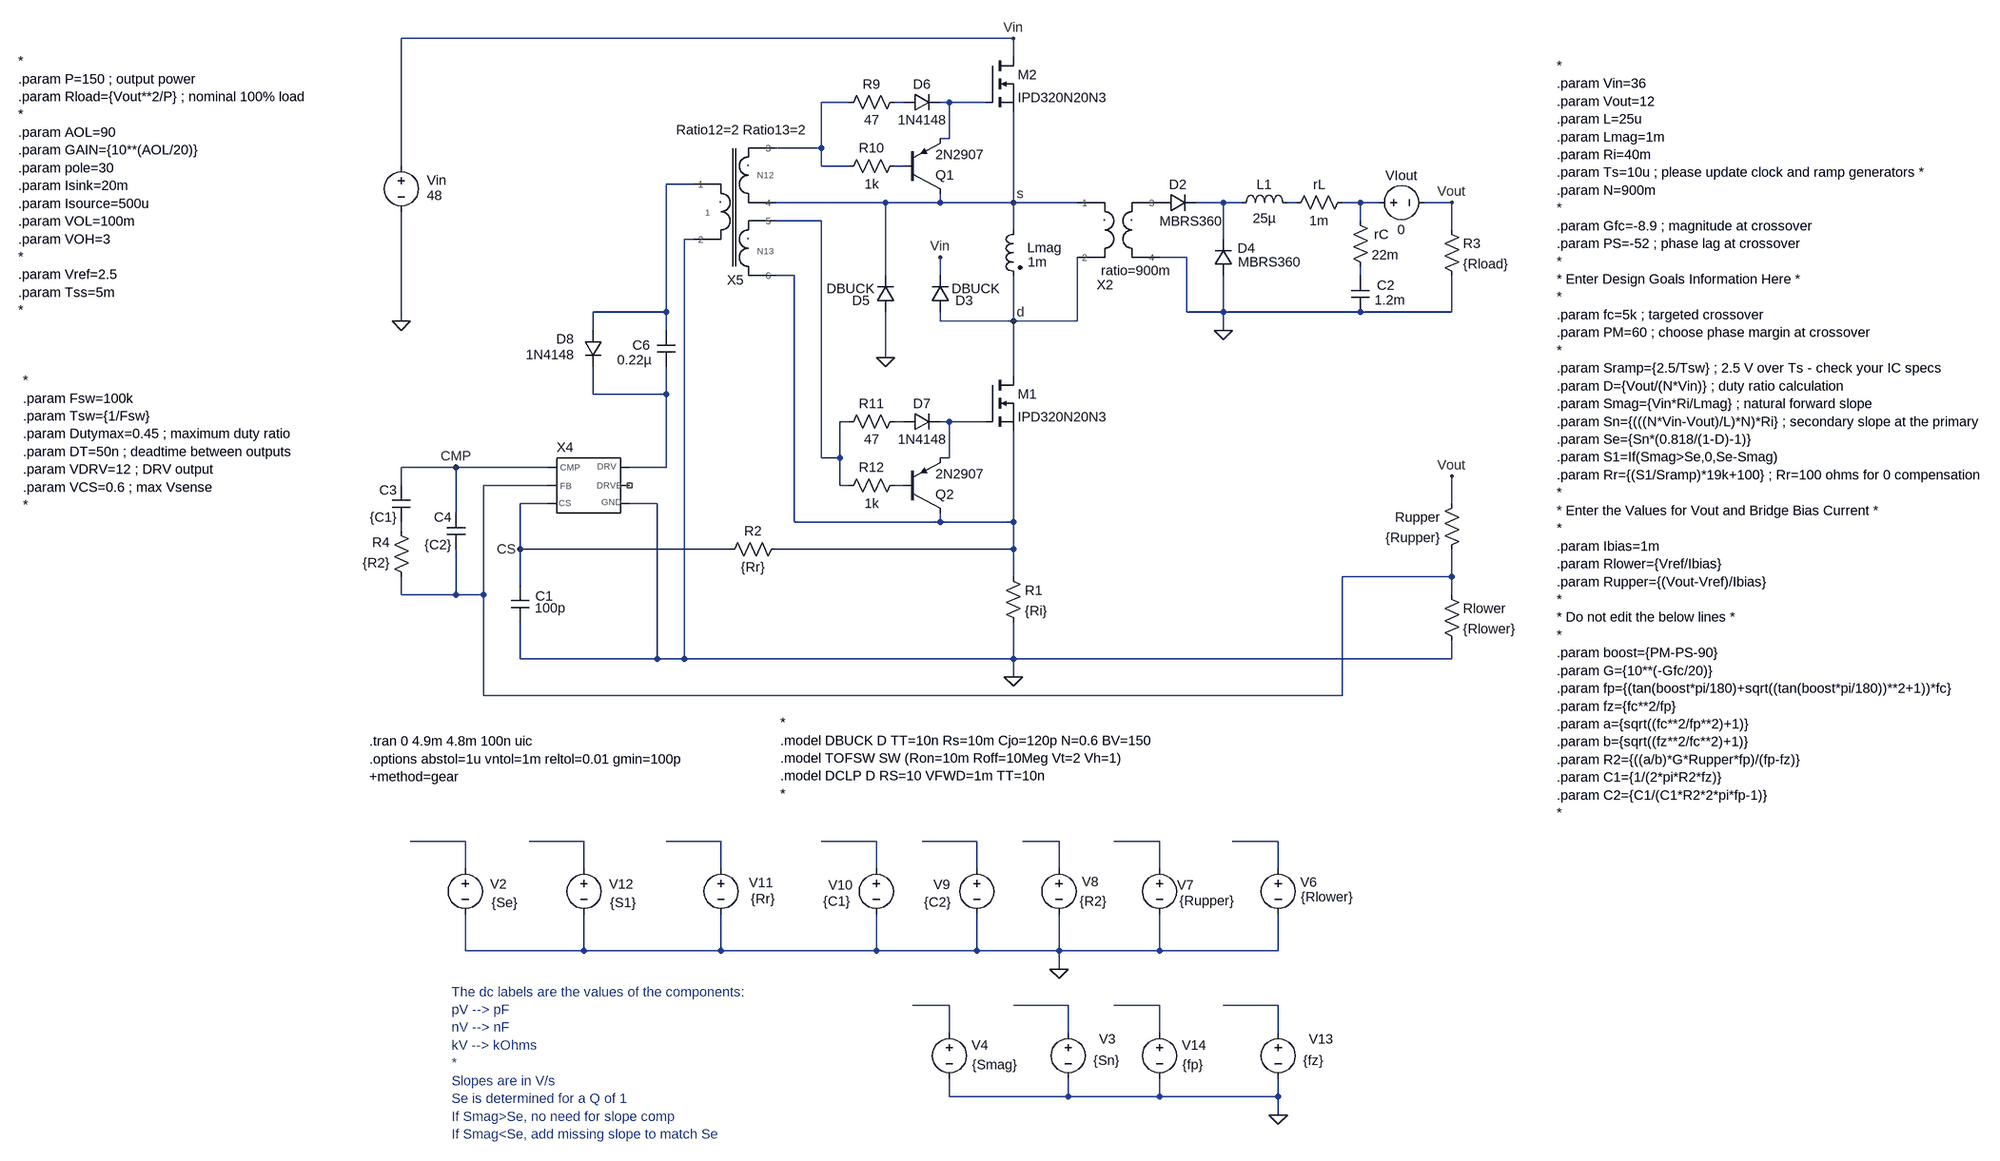
[diagram p0: schematic Forward CM - 2SW - nonisolated - cbc.asc]
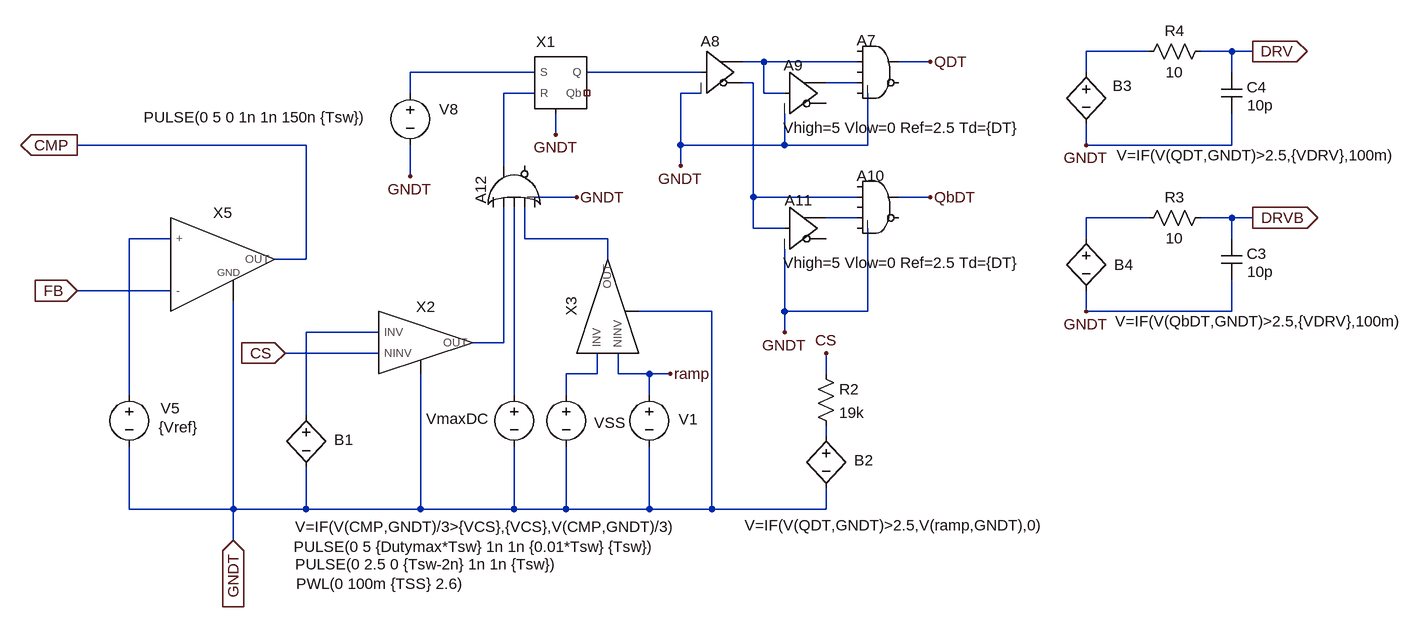
[diagram p1: sub-circuit generic_cm_pwm.asc]
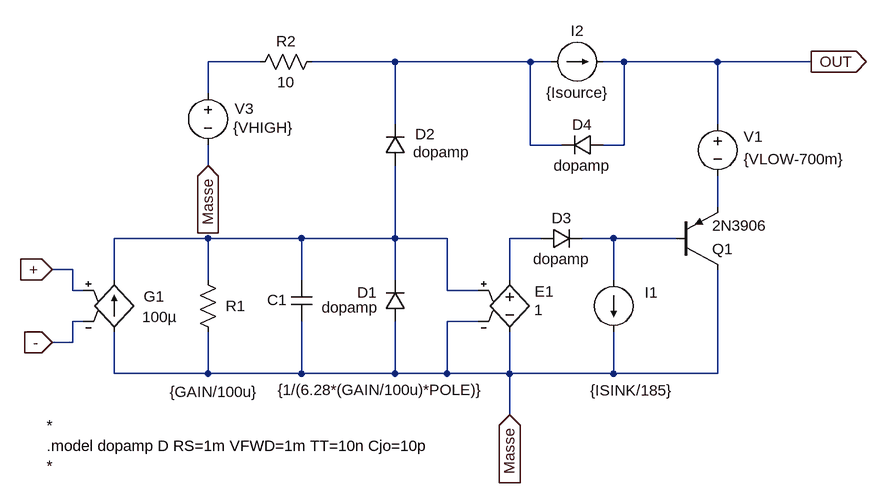
[diagram p2: sub-circuit op_amp_fan_out.asc]
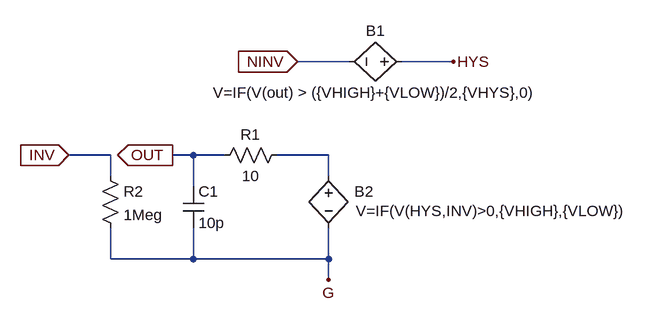
[diagram p3: sub-circuit comptof_g.asc]
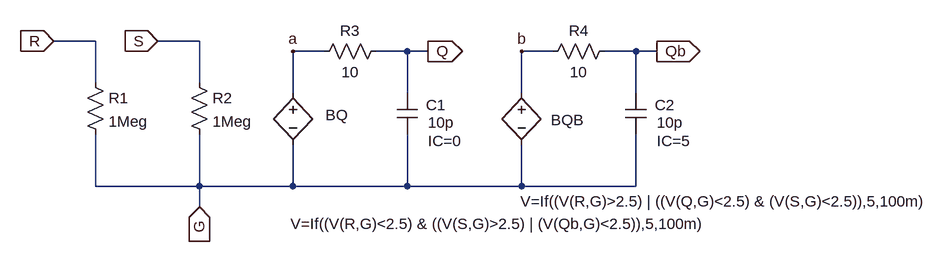
[diagram p4: sub-circuit sr_latch_g.asc]
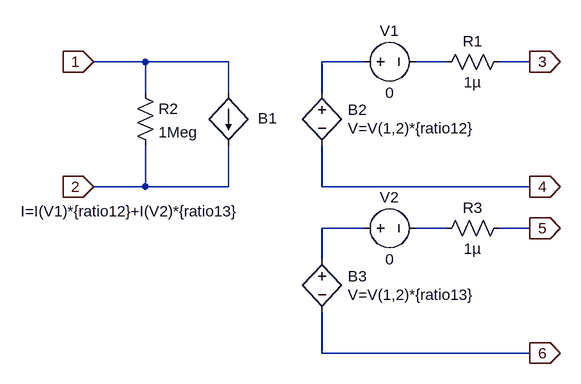
[diagram p5: sub-circuit xfmr_3w.asc]
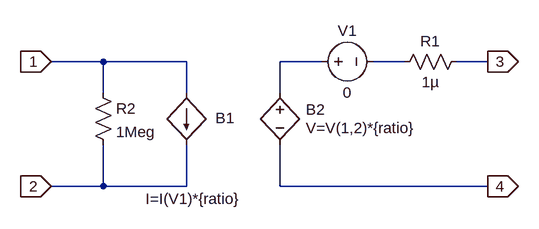
[diagram p6: sub-circuit xfmr.asc]
Forward CM - 2SW - nonisolated - cbc.asc, the LTspice schematic file:
Version 4.1
SHEET 1 3588 2312
WIRE 560 -496 -512 -496
WIRE 560 -464 560 -496
WIRE 272 -384 224 -384
WIRE 368 -384 352 -384
WIRE 448 -384 432 -384
WIRE 512 -384 448 -384
WIRE 448 -320 448 -384
WIRE 448 -320 432 -320
WIRE 224 -304 224 -384
WIRE 224 -304 144 -304
WIRE -512 -272 -512 -496
WIRE 224 -272 224 -304
WIRE 272 -272 224 -272
WIRE 368 -272 352 -272
WIRE 0 -240 -48 -240
WIRE 336 -208 144 -208
WIRE 432 -208 432 -224
WIRE 432 -208 336 -208
WIRE 560 -208 560 -368
WIRE 560 -208 432 -208
WIRE 672 -208 560 -208
WIRE 928 -208 880 -208
WIRE 960 -208 928 -208
WIRE 1056 -208 1040 -208
WIRE 1168 -208 1136 -208
WIRE 1200 -208 1168 -208
WIRE 1328 -208 1280 -208
WIRE 224 -176 144 -176
WIRE 1168 -176 1168 -208
WIRE 560 -160 560 -208
WIRE 1328 -160 1328 -208
WIRE 0 -144 -16 -144
WIRE 928 -144 928 -208
WIRE 864 -112 816 -112
WIRE 176 -80 144 -80
WIRE 336 -80 336 -208
WIRE 432 -80 432 -112
WIRE 1168 -80 1168 -96
WIRE -48 -16 -48 -240
WIRE -48 -16 -176 -16
WIRE 864 -16 864 -112
WIRE 928 -16 928 -80
WIRE 928 -16 864 -16
WIRE 1168 -16 928 -16
WIRE 1328 -16 1328 -80
WIRE 1328 -16 1168 -16
WIRE -512 0 -512 -192
WIRE 432 0 432 -16
WIRE 560 0 560 -80
WIRE 560 0 432 0
WIRE 672 0 672 -112
WIRE 672 0 560 0
WIRE -176 16 -176 -16
WIRE -48 16 -48 -16
WIRE 928 16 928 -16
WIRE 336 64 336 -16
WIRE 560 96 560 0
WIRE -176 128 -176 80
WIRE -48 128 -48 80
WIRE -48 128 -176 128
WIRE 272 176 256 176
WIRE 368 176 352 176
WIRE 448 176 432 176
WIRE 512 176 448 176
WIRE 224 240 224 -176
WIRE 256 240 256 176
WIRE 256 240 224 240
WIRE 448 240 448 176
WIRE 448 240 432 240
WIRE -416 256 -512 256
WIRE -256 256 -416 256
WIRE -48 256 -48 128
WIRE -48 256 -112 256
WIRE -512 288 -512 256
WIRE -256 288 -368 288
WIRE 256 288 256 240
WIRE 272 288 256 288
WIRE 368 288 352 288
WIRE -256 320 -304 320
WIRE -64 320 -112 320
WIRE 1328 320 1328 272
WIRE -416 336 -416 256
WIRE 176 352 176 -80
WIRE 432 352 432 336
WIRE 432 352 176 352
WIRE 560 352 560 192
WIRE 560 352 432 352
WIRE -512 368 -512 352
WIRE -304 400 -304 320
WIRE 64 400 -304 400
WIRE 560 400 560 352
WIRE 560 400 144 400
WIRE 560 448 560 400
WIRE 1328 448 1328 400
WIRE 1328 448 1136 448
WIRE -304 464 -304 400
WIRE -512 480 -512 448
WIRE -416 480 -416 400
WIRE -416 480 -512 480
WIRE -368 480 -368 288
WIRE -368 480 -416 480
WIRE 1328 480 1328 448
WIRE -304 592 -304 528
WIRE -64 592 -64 320
WIRE -64 592 -304 592
WIRE -16 592 -16 -144
WIRE -16 592 -64 592
WIRE 560 592 560 528
WIRE 560 592 -16 592
WIRE 1328 592 1328 560
WIRE 1328 592 560 592
WIRE 560 624 560 592
WIRE -368 656 -368 480
WIRE 1136 656 1136 448
WIRE 1136 656 -368 656
WIRE -400 912 -496 912
WIRE -192 912 -288 912
WIRE 48 912 -48 912
WIRE 320 912 224 912
WIRE 496 912 400 912
WIRE 640 912 576 912
WIRE 816 912 736 912
WIRE 1024 912 944 912
WIRE -400 960 -400 912
WIRE -192 960 -192 912
WIRE 48 960 48 912
WIRE 320 960 320 912
WIRE 496 960 496 912
WIRE 640 960 640 912
WIRE 816 960 816 912
WIRE 1024 960 1024 912
WIRE -400 1104 -400 1040
WIRE -192 1104 -192 1040
WIRE -192 1104 -400 1104
WIRE 48 1104 48 1040
WIRE 48 1104 -192 1104
WIRE 320 1104 320 1040
WIRE 320 1104 48 1104
WIRE 496 1104 496 1040
WIRE 496 1104 320 1104
WIRE 640 1104 640 1040
WIRE 640 1104 496 1104
WIRE 816 1104 816 1040
WIRE 816 1104 640 1104
WIRE 1024 1104 1024 1040
WIRE 1024 1104 816 1104
WIRE 640 1136 640 1104
WIRE 448 1200 384 1200
WIRE 656 1200 560 1200
WIRE 816 1200 736 1200
WIRE 1024 1200 928 1200
WIRE 448 1248 448 1200
WIRE 656 1248 656 1200
WIRE 816 1248 816 1200
WIRE 1024 1248 1024 1200
WIRE 448 1360 448 1328
WIRE 656 1360 656 1328
WIRE 656 1360 448 1360
WIRE 816 1360 816 1328
WIRE 816 1360 656 1360
WIRE 1024 1360 1024 1328
WIRE 1024 1360 816 1360
WIRE 1024 1392 1024 1360
FLAG 928 16 0
FLAG -512 0 0
FLAG 1328 -208 Vout
FLAG 1328 272 Vout
FLAG 640 1136 0
FLAG 1024 1392 0
FLAG 560 624 0
FLAG -304 400 CS
FLAG 560 0 d
FLAG 560 -496 Vin
FLAG 432 -112 Vin
FLAG 336 64 0
FLAG 560 -208 s
FLAG -416 256 CMP
DATAFLAG 240 912 ""
DATAFLAG 432 912 ""
DATAFLAG 608 912 ""
DATAFLAG 752 912 ""
DATAFLAG 976 912 ""
DATAFLAG -256 912 ""
DATAFLAG -16 912 ""
DATAFLAG 944 1200 ""
DATAFLAG 784 1200 ""
DATAFLAG -464 912 ""
DATAFLAG 576 1200 ""
DATAFLAG 416 1200 ""
SYMBOL res 544 432 R0
SYMATTR InstName R1
SYMATTR Value {Ri}
SYMBOL res 160 384 R90
WINDOW 0 0 56 VBottom 2
WINDOW 3 32 56 VTop 2
SYMATTR InstName R2
SYMATTR Value {Rr}
SYMBOL diode 816 -224 M90
WINDOW 0 0 32 VBottom 2
WINDOW 3 33 55 VTop 2
SYMATTR InstName D2
SYMATTR Value MBRS360
SYMBOL ind 944 -192 R270
WINDOW 0 32 56 VTop 2
WINDOW 3 4 56 VBottom 2
SYMATTR InstName L1
SYMATTR Value 25µ
SYMBOL res 1152 -224 R90
WINDOW 0 0 56 VBottom 2
WINDOW 3 32 56 VTop 2
SYMATTR InstName rL
SYMATTR Value 1m
SYMBOL res 1152 -192 R0
WINDOW 0 40 40 Left 2
SYMATTR InstName rC
SYMATTR Value 22m
SYMBOL cap 1152 -80 R0
WINDOW 0 45 17 Left 2
WINDOW 3 41 43 Left 2
SYMATTR InstName C2
SYMATTR Value 1.2m
SYMBOL res 1312 -176 R0
SYMATTR InstName R3
SYMATTR Value {Rload}
SYMBOL voltage -512 -288 R0
WINDOW 0 45 41 Left 2
WINDOW 3 45 68 Left 2
SYMATTR InstName Vin
SYMATTR Value 48
SYMBOL cap -320 464 R0
WINDOW 0 43 18 Left 2
WINDOW 3 42 39 Left 2
SYMATTR InstName C1
SYMATTR Value 100p
SYMBOL res 1312 464 R0
SYMATTR InstName Rlower
SYMATTR Value {Rlower}
SYMBOL res 1344 304 M0
SYMATTR InstName Rupper
SYMATTR Value {Rupper}
SYMBOL cap -496 352 R180
WINDOW 0 24 56 Left 2
WINDOW 3 24 8 Left 2
SYMATTR InstName C3
SYMATTR Value {C1}
SYMBOL res -496 464 R180
WINDOW 0 36 76 Left 2
WINDOW 3 36 40 Left 2
SYMATTR InstName R4
SYMATTR Value {R2}
SYMBOL cap -400 400 R180
WINDOW 0 24 56 Left 2
WINDOW 3 24 8 Left 2
SYMATTR InstName C4
SYMATTR Value {C2}
SYMBOL diode 912 -80 M180
WINDOW 0 41 48 Left 2
WINDOW 3 42 24 Left 2
SYMATTR InstName D4
SYMATTR Value MBRS360
SYMBOL voltage 1024 944 R0
WINDOW 0 39 40 Left 2
WINDOW 3 40 66 Left 2
WINDOW 123 0 0 Left 0
WINDOW 39 0 0 Left 0
SYMATTR InstName V6
SYMATTR Value {Rlower}
SYMBOL voltage 816 944 R0
WINDOW 0 31 45 Left 2
WINDOW 3 35 72 Left 2
WINDOW 123 0 0 Left 0
WINDOW 39 0 0 Left 0
SYMATTR InstName V7
SYMATTR Value {Rupper}
SYMBOL voltage 640 944 R0
WINDOW 0 40 39 Left 2
WINDOW 3 36 73 Left 2
WINDOW 123 0 0 Left 0
WINDOW 39 0 0 Left 0
SYMATTR InstName V8
SYMATTR Value {R2}
SYMBOL voltage 496 944 R0
WINDOW 0 -76 44 Left 2
WINDOW 3 -92 75 Left 2
SYMATTR InstName V9
SYMATTR Value {C2}
SYMBOL voltage 320 944 R0
WINDOW 0 -84 45 Left 2
WINDOW 3 -93 73 Left 2
WINDOW 123 0 0 Left 0
WINDOW 39 0 0 Left 0
SYMATTR InstName V10
SYMATTR Value {C1}
SYMBOL voltage 48 944 R0
WINDOW 0 49 41 Left 2
WINDOW 3 52 69 Left 2
SYMATTR InstName V11
SYMATTR Value {Rr}
SYMBOL voltage -192 944 R0
WINDOW 0 44 43 Left 2
WINDOW 3 46 76 Left 2
SYMATTR InstName V12
SYMATTR Value {S1}
SYMBOL voltage 1024 1232 R0
WINDOW 0 54 27 Left 2
WINDOW 3 44 64 Left 2
WINDOW 123 0 0 Left 0
WINDOW 39 0 0 Left 0
SYMATTR InstName V13
SYMATTR Value {fz}
SYMBOL voltage 816 1232 R0
WINDOW 0 39 38 Left 2
WINDOW 3 40 72 Left 2
SYMATTR InstName V14
SYMATTR Value {fp}
SYMBOL voltage 1184 -208 R270
WINDOW 0 32 56 VTop 2
WINDOW 3 -32 56 VBottom 2
SYMATTR InstName VIout
SYMATTR Value 0
SYMBOL voltage -400 944 R0
WINDOW 0 44 43 Left 2
WINDOW 3 46 76 Left 2
SYMATTR InstName V2
SYMATTR Value {Se}
SYMBOL voltage 656 1232 R0
WINDOW 0 54 27 Left 2
WINDOW 3 44 64 Left 2
WINDOW 123 0 0 Left 0
WINDOW 39 0 0 Left 0
SYMATTR InstName V3
SYMATTR Value {Sn}
SYMBOL voltage 448 1232 R0
WINDOW 0 39 38 Left 2
WINDOW 3 40 72 Left 2
SYMATTR InstName V4
SYMATTR Value {Smag}
SYMBOL ind2 576 -176 M0
WINDOW 0 -69 47 Left 2
WINDOW 3 -43 72 Left 2
SYMATTR InstName Lmag
SYMATTR Value 1m
SYMATTR Type ind
SYMBOL diode 416 -16 M180
WINDOW 0 43 20 Left 2
WINDOW 3 36 41 Left 2
SYMATTR InstName D3
SYMATTR Value DBUCK
SYMBOL diode 352 -16 R180
WINDOW 0 43 20 Left 2
WINDOW 3 36 41 Left 2
SYMATTR InstName D5
SYMATTR Value DBUCK
SYMBOL nmos 512 96 R0
SYMATTR InstName M1
SYMATTR Value IPD320N20N3
SYMBOL cap -32 80 R180
WINDOW 0 44 38 Left 2
WINDOW 3 41 12 Left 2
SYMATTR InstName C6
SYMATTR Value 0.22µ
SYMBOL res 368 -400 R90
WINDOW 0 0 56 VBottom 2
WINDOW 3 32 56 VTop 2
SYMATTR InstName R9
SYMATTR Value 47
SYMBOL diode 368 -368 R270
WINDOW 0 32 32 VTop 2
WINDOW 3 0 32 VBottom 2
SYMATTR InstName D6
SYMATTR Value 1N4148
SYMBOL pnp 368 -224 M180
SYMATTR InstName Q1
SYMATTR Value 2N2907
SYMBOL res 368 -288 R90
WINDOW 0 0 56 VBottom 2
WINDOW 3 32 56 VTop 2
SYMATTR InstName R10
SYMATTR Value 1k
SYMBOL nmos 512 -464 R0
SYMATTR InstName M2
SYMATTR Value IPD320N20N3
SYMBOL res 368 160 R90
WINDOW 0 0 56 VBottom 2
WINDOW 3 32 56 VTop 2
SYMATTR InstName R11
SYMATTR Value 47
SYMBOL diode 368 192 R270
WINDOW 0 32 32 VTop 2
WINDOW 3 0 32 VBottom 2
SYMATTR InstName D7
SYMATTR Value 1N4148
SYMBOL pnp 368 336 M180
SYMATTR InstName Q2
SYMATTR Value 2N2907
SYMBOL res 368 272 R90
WINDOW 0 0 56 VBottom 2
WINDOW 3 32 56 VTop 2
SYMATTR InstName R12
SYMATTR Value 1k
SYMBOL diode -160 16 M0
WINDOW 0 50 15 Left 2
WINDOW 3 49 43 Left 2
SYMATTR InstName D8
SYMATTR Value 1N4148
SYMBOL TOF\\Subcircuits\\Generic_CM_PWM -192 256 R0
WINDOW 0 -33 -19 Bottom 2
SYMATTR InstName X4
SYMATTR SpiceLine gain={gain} pole={pole} Isink={Isink} Isource={Isource} Vlow={VOL} Vhigh={VOH}
SYMBOL TOF\\Subcircuits\\XFMR_3W 32 -288 R0
WINDOW 0 41 232 Bottom 2
WINDOW 39 52 -32 Bottom 2
SYMATTR InstName X5
SYMATTR SpiceLine Ratio12=2 Ratio13=2
SYMBOL TOF\\Subcircuits\\XFMR 704 -192 R0
WINDOW 0 17 144 Bottom 2
WINDOW 39 71 119 Bottom 2
SYMATTR InstName X2
SYMATTR SpiceLine ratio=900m
TEXT 152 704 Left 2 !*\n.model DBUCK D TT=10n Rs=10m Cjo=120p N=0.6 BV=150\n.model TOFSW SW (Ron=10m Roff=10Meg Vt=2 Vh=1)\n.model DCLP D RS=10 VFWD=1m TT=10n\n*
TEXT 1512 -448 Left 2 !*\n.param Vin=36\n.param Vout=12\n.param L=25u\n.param Lmag=1m\n.param Ri=40m\n.param Ts=10u ; please update clock and ramp generators *\n.param N=900m\n*\n.param Gfc=-8.9 ; magnitude at crossover\n.param PS=-52 ; phase lag at crossover\n*\n* Enter Design Goals Information Here *\n*\n.param fc=5k ; targeted crossover\n.param PM=60 ; choose phase margin at crossover\n*\n.param Sramp={2.5/Tsw} ; 2.5 V over Ts - check your IC specs\n.param D={Vout/(N*Vin)} ; duty ratio calculation\n.param Smag={Vin*Ri/Lmag} ; natural forward slope\n.param Sn={(((N*Vin-Vout)/L)*N)*Ri} ; secondary slope at the primary\n.param Se={Sn*(0.818/(1-D)-1)}\n.param S1=If(Smag>Se,0,Se-Smag)\n.param Rr={(S1/Sramp)*19k+100} ; Rr=100 ohms for 0 compensation\n*\n* Enter the Values for Vout and Bridge Bias Current *\n*\n.param Ibias=1m\n.param Rlower={Vref/Ibias}\n.param Rupper={(Vout-Vref)/Ibias}\n*\n* Do not edit the below lines *\n*\n.param boost={PM-PS-90}\n.param G={10**(-Gfc/20)}\n.param fp={(tan(boost*pi/180)+sqrt((tan(boost*pi/180))**2+1))*fc}\n.param fz={fc**2/fp}\n.param a={sqrt((fc**2/fp**2)+1)}\n.param b={sqrt((fz**2/fc**2)+1)}\n.param R2={((a/b)*G*Rupper*fp)/(fp-fz)}\n.param C1={1/(2*pi*R2*fz)}\n.param C2={C1/(C1*R2*2*pi*fp-1)}\n*
TEXT -568 736 Left 2 !.tran 0 4.9m 4.8m 100n uic
TEXT -568 768 Left 2 !.options abstol=1u vntol=1m reltol=0.01 gmin=100p\n+method=gear
TEXT -424 1176 Left 2 ;The dc labels are the values of the components:\npV --> pF\nnV --> nF\nkV --> kOhms\n*\nSlopes are in V/s\nSe is determined for a Q of 1\nIf Smag>Se, no need for slope comp\nIf Smag<Se, add missing slope to match Se
TEXT -1360 104 Left 2 !*\n.param Fsw=100k\n.param Tsw={1/Fsw}\n.param Dutymax=0.45 ; maximum duty ratio\n.param DT=50n ; deadtime between outputs\n.param VDRV=12 ; DRV output\n.param VCS=0.6 ; max Vsense\n*
TEXT -1368 -456 Left 2 !*\n.param P=150 ; output power\n.param Rload={Vout**2/P} ; nominal 100% load\n* \n.param AOL=90\n.param GAIN={10**(AOL/20)}\n.param pole=30\n.param Isink=20m\n.param Isource=500u\n.param VOL=100m\n.param VOH=3\n*\n.param Vref=2.5\n.param Tss=5m\n*

generic_cm_pwm.asc, the sub-circuit schematic file:
Version 4.1
SHEET 1 1744 1720
WIRE 448 816 352 816
WIRE 576 816 528 816
WIRE 608 816 576 816
WIRE -144 832 -176 832
WIRE 0 832 -144 832
WIRE 112 832 64 832
WIRE -496 848 -688 848
WIRE -240 848 -416 848
WIRE 352 848 352 816
WIRE 576 848 576 816
WIRE -160 864 -176 864
WIRE 0 864 -48 864
WIRE -688 880 -688 848
WIRE -496 880 -544 880
WIRE -240 880 -272 880
WIRE -144 880 -144 832
WIRE -112 880 -144 880
WIRE -464 944 -464 912
WIRE -848 960 -1200 960
WIRE -272 960 -272 880
WIRE -112 960 -112 912
WIRE -112 960 -272 960
WIRE 16 960 16 880
WIRE 16 960 -112 960
WIRE 352 960 352 928
WIRE 576 960 576 912
WIRE 576 960 352 960
WIRE -544 992 -544 880
WIRE -272 992 -272 960
WIRE -688 1008 -688 960
WIRE -432 1040 -496 1040
WIRE -160 1040 -160 864
WIRE 0 1040 -160 1040
WIRE 112 1040 64 1040
WIRE 0 1072 -48 1072
WIRE 448 1072 352 1072
WIRE 576 1072 528 1072
WIRE 608 1072 576 1072
WIRE -160 1088 -160 1040
WIRE -112 1088 -160 1088
WIRE -1056 1104 -1120 1104
WIRE -512 1104 -512 1056
WIRE -384 1104 -512 1104
WIRE 352 1104 352 1072
WIRE 576 1104 576 1072
WIRE -848 1136 -848 960
WIRE -848 1136 -896 1136
WIRE -384 1136 -384 1104
WIRE -1056 1184 -1200 1184
WIRE -224 1216 -336 1216
WIRE -112 1216 -112 1120
WIRE 16 1216 16 1088
WIRE 16 1216 -112 1216
WIRE 352 1216 352 1184
WIRE 576 1216 576 1168
WIRE 576 1216 352 1216
WIRE -736 1248 -848 1248
WIRE -112 1248 -112 1216
WIRE -544 1264 -544 1056
WIRE -544 1264 -592 1264
WIRE -736 1280 -880 1280
WIRE -400 1312 -400 1280
WIRE -400 1312 -448 1312
WIRE -368 1312 -368 1280
WIRE -320 1312 -368 1312
WIRE -288 1312 -320 1312
WIRE -48 1312 -48 1280
WIRE -1120 1344 -1120 1104
WIRE -528 1344 -528 1056
WIRE -448 1344 -448 1312
WIRE -320 1344 -320 1312
WIRE -848 1376 -848 1248
WIRE -48 1408 -48 1392
WIRE -1120 1520 -1120 1424
WIRE -960 1520 -960 1200
WIRE -960 1520 -1120 1520
WIRE -848 1520 -848 1456
WIRE -848 1520 -960 1520
WIRE -672 1520 -672 1312
WIRE -672 1520 -848 1520
WIRE -528 1520 -528 1424
WIRE -528 1520 -672 1520
WIRE -448 1520 -448 1424
WIRE -448 1520 -528 1520
WIRE -320 1520 -320 1424
WIRE -320 1520 -448 1520
WIRE -224 1520 -224 1216
WIRE -224 1520 -320 1520
WIRE -48 1520 -48 1488
WIRE -48 1520 -224 1520
WIRE -960 1568 -960 1520
FLAG 112 832 QDT
FLAG 112 1040 QbDT
FLAG 352 1216 GNDT
FLAG 352 960 GNDT
FLAG 608 1072 DRVB
IOPIN 608 1072 Out
FLAG 608 816 DRV
IOPIN 608 816 Out
FLAG -1200 960 CMP
IOPIN -1200 960 Out
FLAG -1200 1184 FB
IOPIN -1200 1184 In
FLAG -880 1280 CS
IOPIN -880 1280 In
FLAG -960 1568 GNDT
IOPIN -960 1568 In
FLAG -688 1008 GNDT
FLAG -112 1248 GNDT
FLAG -272 992 GNDT
FLAG -464 944 GNDT
FLAG -432 1040 GNDT
FLAG -288 1312 ramp
FLAG -48 1280 CS
SYMBOL Digital\\and 32 784 R0
WINDOW 0 -33 15 Left 2
SYMATTR InstName A7
SYMATTR SpiceLine Vhigh=5 Vlow=0 Ref=2.5
SYMBOL Digital\\buf -240 784 R0
WINDOW 0 -1 16 Left 2
SYMATTR InstName A8
SYMATTR SpiceLine Vhigh=5 Vlow=0 Ref=1.0
SYMBOL Digital\\buf -112 816 R0
WINDOW 0 -1 21 Left 2
WINDOW 39 -2 117 Left 2
SYMATTR InstName A9
SYMATTR SpiceLine Vhigh=5 Vlow=0 Ref=2.5 Td={DT}
SYMBOL Digital\\and 32 992 R0
WINDOW 0 -33 15 Left 2
SYMATTR InstName A10
SYMATTR SpiceLine Vhigh=5 Vlow=0 Ref=2.5
SYMBOL Digital\\buf -112 1024 R0
WINDOW 0 0 21 Left 2
WINDOW 39 -2 117 Left 2
SYMATTR InstName A11
SYMATTR SpiceLine Vhigh=5 Vlow=0 Ref=2.5 Td={DT}
SYMBOL bv 352 832 R0
WINDOW 0 41 37 Left 2
WINDOW 3 47 144 Left 2
SYMATTR InstName B3
SYMATTR Value V=IF(V(QDT,GNDT)>2.5,{VDRV},100m)
SYMBOL bv 352 1088 R0
WINDOW 0 43 56 Left 2
WINDOW 3 45 143 Left 2
SYMATTR InstName B4
SYMATTR Value V=IF(V(QbDT,GNDT)>2.5,{VDRV},100m)
SYMBOL res 544 1056 R90
WINDOW 0 0 56 VBottom 2
WINDOW 3 32 56 VTop 2
SYMATTR InstName R3
SYMATTR Value 10
SYMBOL cap 560 1104 R0
WINDOW 0 39 23 Left 2
WINDOW 3 40 51 Left 2
SYMATTR InstName C3
SYMATTR Value 10p
SYMBOL res 544 800 R90
WINDOW 0 0 56 VBottom 2
WINDOW 3 32 56 VTop 2
SYMATTR InstName R4
SYMATTR Value 10
SYMBOL cap 560 848 R0
WINDOW 0 39 23 Left 2
WINDOW 3 40 51 Left 2
SYMATTR InstName C4
SYMATTR Value 10p
SYMBOL op_amp_fan_out -976 1136 R0
SYMATTR InstName X5
SYMATTR SpiceLine gain={gain} pole={pole} Isink={Isink} Isource={Isource} Vlow={VOL} Vhigh={VOH}
SYMBOL Digital\\or -592 1024 R270
WINDOW 0 -27 13 Left 2
SYMATTR InstName A12
SYMATTR SpiceLine Vhigh=5 Vlow=0 Ref=2.5
SYMBOL voltage -1120 1328 R0
WINDOW 0 48 37 Left 2
WINDOW 3 45 66 Left 2
SYMATTR InstName V5
SYMATTR Value {Vref}
SYMBOL voltage -688 864 R0
WINDOW 0 45 41 Left 2
WINDOW 3 -410 53 Left 2
WINDOW 123 0 0 Left 0
WINDOW 39 0 0 Left 0
SYMATTR InstName V8
SYMATTR Value PULSE(0 5 0 1n 1n 150n {Tsw})
SYMBOL voltage -528 1328 R0
WINDOW 0 -135 53 Left 2
WINDOW 3 -339 250 Left 2
WINDOW 123 0 0 Left 0
WINDOW 39 0 0 Left 0
SYMATTR InstName VmaxDC
SYMATTR Value PULSE(0 5 {Dutymax*Tsw} 1n 1n {0.01*Tsw} {Tsw})
SYMBOL bv -848 1360 R0
WINDOW 0 43 53 Left 2
WINDOW 3 -17 187 Left 2
SYMATTR InstName B1
SYMATTR Value V=IF(V(CMP,GNDT)/3>{VCS},{VCS},V(CMP,GNDT)/3)
SYMBOL voltage -320 1328 R0
WINDOW 0 45 54 Left 2
WINDOW 3 -545 277 Left 2
WINDOW 123 0 0 Left 0
WINDOW 39 0 0 Left 0
SYMATTR InstName V1
SYMATTR Value PULSE(0 2.5 0 {Tsw-2n} 1n 1n {Tsw})
SYMBOL voltage -448 1328 R0
WINDOW 0 43 59 Left 2
WINDOW 3 -415 307 Left 2
WINDOW 123 0 0 Left 0
WINDOW 39 0 0 Left 0
SYMATTR InstName VSS
SYMATTR Value PWL(0 100m {TSS} 2.6)
SYMBOL res -64 1296 R0
SYMATTR InstName R2
SYMATTR Value 19k
SYMBOL bv -48 1392 R0
WINDOW 0 43 53 Left 2
WINDOW 3 -125 153 Left 2
SYMATTR InstName B2
SYMATTR Value V=IF(V(QDT,GNDT)>2.5,V(ramp,GNDT),0)
SYMBOL TOF\\Subcircuits\\COMPTOF_G -672 1264 R0
SYMATTR InstName X2
SYMATTR SpiceLine VHIGH=5 VLOW=100m VHYS=10m
SYMBOL TOF\\Subcircuits\\COMPTOF_G -384 1216 R270
SYMATTR InstName X3
SYMATTR SpiceLine VHIGH=5 VLOW=100m VHYS=10m
SYMBOL TOF\\Subcircuits\\SR_latch_G -464 864 R0
WINDOW 0 -15 -47 Bottom 2
SYMATTR InstName X1

op_amp_fan_out.asc, the sub-circuit schematic file:
Version 4.1
SHEET 1 1504 680
WIRE 96 -224 16 -224
WIRE 304 -224 176 -224
WIRE 512 -224 304 -224
WIRE 544 -224 512 -224
WIRE 656 -224 624 -224
WIRE 800 -224 656 -224
WIRE 944 -224 800 -224
WIRE 16 -176 16 -224
WIRE 304 -128 304 -224
WIRE 800 -128 800 -224
WIRE 512 -96 512 -224
WIRE 560 -96 512 -96
WIRE 656 -96 656 -224
WIRE 656 -96 624 -96
WIRE 16 -64 16 -96
WIRE 800 0 800 -48
WIRE 16 48 -128 48
WIRE 160 48 16 48
WIRE 304 48 304 -64
WIRE 304 48 160 48
WIRE 384 48 304 48
WIRE 528 48 480 48
WIRE 640 48 592 48
WIRE 736 48 640 48
WIRE -192 96 -224 96
WIRE -128 112 -128 48
WIRE 16 112 16 48
WIRE 160 112 160 48
WIRE 304 112 304 48
WIRE 480 112 480 48
WIRE 640 112 640 48
WIRE -192 128 -192 96
WIRE -176 128 -192 128
WIRE 384 128 384 48
WIRE 432 128 384 128
WIRE -176 176 -192 176
WIRE 432 176 384 176
WIRE -192 208 -192 176
WIRE -192 208 -224 208
WIRE -128 256 -128 192
WIRE 16 256 16 192
WIRE 16 256 -128 256
WIRE 160 256 160 176
WIRE 160 256 16 256
WIRE 304 256 304 176
WIRE 304 256 160 256
WIRE 384 256 384 176
WIRE 384 256 304 256
WIRE 480 256 480 192
WIRE 480 256 384 256
WIRE 640 256 640 192
WIRE 640 256 480 256
WIRE 800 256 800 96
WIRE 800 256 640 256
WIRE 480 320 480 256
FLAG -224 96 +
IOPIN -224 96 In
FLAG -224 208 -
IOPIN -224 208 In
FLAG 944 -224 OUT
IOPIN 944 -224 Out
FLAG 480 320 Masse
IOPIN 480 320 In
FLAG 16 -64 Masse
IOPIN 16 -64 In
DATAFLAG 800 -16 ""
SYMBOL g -128 96 R0
WINDOW 0 45 41 Left 2
WINDOW 3 43 73 Left 2
SYMATTR InstName G1
SYMATTR Value 100µ
SYMBOL res 0 96 R0
WINDOW 0 43 56 Left 2
WINDOW 3 -43 188 Left 2
SYMATTR InstName R1
SYMATTR Value {GAIN/100u}
SYMBOL cap 144 112 R0
WINDOW 0 -37 31 Left 2
WINDOW 3 -21 169 Left 2
SYMATTR InstName C1
SYMATTR Value {1/(6.28*(GAIN/100u)*POLE)}
SYMBOL diode 320 176 R180
WINDOW 0 44 45 Left 2
WINDOW 3 41 22 Left 2
SYMATTR InstName D1
SYMATTR Value dopamp
SYMBOL e 480 96 R0
WINDOW 0 39 34 Left 2
WINDOW 3 38 62 Left 2
SYMATTR InstName E1
SYMATTR Value 1
SYMBOL diode 528 64 R270
WINDOW 0 32 32 VTop 2
WINDOW 3 0 32 VBottom 2
SYMATTR InstName D3
SYMATTR Value dopamp
SYMBOL current 640 112 R0
WINDOW 0 48 19 Left 2
WINDOW 3 -36 170 Left 2
SYMATTR InstName I1
SYMATTR Value {ISINK/185}
SYMBOL pnp 736 96 M180
SYMATTR InstName Q1
SYMATTR Value 2N3906
SYMBOL voltage 800 -144 R0
WINDOW 0 40 35 Left 2
WINDOW 3 40 70 Left 2
SYMATTR InstName V1
SYMATTR Value {VLOW-700m}
SYMBOL current 544 -224 R270
WINDOW 0 32 40 VTop 2
WINDOW 3 -32 40 VBottom 2
SYMATTR InstName I2
SYMATTR Value {Isource}
SYMBOL diode 624 -80 M270
WINDOW 0 32 32 VTop 2
WINDOW 3 0 32 VBottom 2
SYMATTR InstName D4
SYMATTR Value dopamp
SYMBOL voltage 16 -192 R0
WINDOW 0 41 40 Left 2
WINDOW 3 39 69 Left 2
SYMATTR InstName V3
SYMATTR Value {VHIGH}
SYMBOL diode 288 -64 M180
WINDOW 0 47 49 Left 2
WINDOW 3 44 21 Left 2
SYMATTR InstName D2
SYMATTR Value dopamp
SYMBOL res 192 -240 R90
WINDOW 0 0 56 VBottom 2
WINDOW 3 32 56 VTop 2
SYMATTR InstName R2
SYMATTR Value 10
TEXT -232 336 Left 2 !*\n.model dopamp D RS=1m VFWD=1m TT=10n Cjo=10p\n*

comptof_g.asc, the sub-circuit schematic file:
Version 4.1
SHEET 1 880 680
WIRE 64 192 -16 192
WIRE 224 192 144 192
WIRE -304 336 -368 336
WIRE -176 336 -208 336
WIRE -128 336 -176 336
WIRE 32 336 -48 336
WIRE -304 368 -304 336
WIRE 32 368 32 336
WIRE -176 384 -176 336
WIRE -304 496 -304 448
WIRE -176 496 -176 448
WIRE -176 496 -304 496
WIRE 32 496 32 448
WIRE 32 496 -176 496
WIRE 32 528 32 496
FLAG -16 192 NINV
IOPIN -16 192 In
FLAG 224 192 HYS
FLAG -208 336 OUT
IOPIN -208 336 Out
FLAG -368 336 INV
IOPIN -368 336 In
FLAG 32 528 G
SYMBOL bv 160 192 R90
WINDOW 0 -32 56 VBottom 2
WINDOW 3 32 56 VTop 2
SYMATTR InstName B1
SYMATTR Value V=IF(V(out) > ({VHIGH}+{VLOW})/2,{VHYS},0)
SYMBOL bv 32 352 R0
WINDOW 0 40 40 Left 2
WINDOW 3 42 70 Left 2
SYMATTR InstName B2
SYMATTR Value V=IF(V(HYS,INV)>0,{VHIGH},{VLOW})
SYMBOL res -32 320 R90
WINDOW 0 0 56 VBottom 2
WINDOW 3 32 56 VTop 2
SYMATTR InstName R1
SYMATTR Value 10
SYMBOL cap -192 384 R0
SYMATTR InstName C1
SYMATTR Value 10p
SYMBOL res -320 352 R0
SYMATTR InstName R2
SYMATTR Value 1Meg

sr_latch_g.asc, the sub-circuit schematic file:
Version 4.1
SHEET 1 1168 680
WIRE -192 48 -256 48
WIRE -32 48 -96 48
WIRE 160 64 112 64
WIRE 288 64 240 64
WIRE 320 64 288 64
WIRE 512 64 464 64
WIRE 640 64 592 64
WIRE 672 64 640 64
WIRE -192 112 -192 48
WIRE -32 112 -32 48
WIRE 112 128 112 64
WIRE 288 128 288 64
WIRE 464 128 464 64
WIRE 640 128 640 64
WIRE -192 272 -192 192
WIRE -32 272 -32 192
WIRE -32 272 -192 272
WIRE 112 272 112 208
WIRE 112 272 -32 272
WIRE 288 272 288 192
WIRE 288 272 112 272
WIRE 464 272 464 208
WIRE 464 272 288 272
WIRE 640 272 640 192
WIRE 640 272 464 272
WIRE -32 304 -32 272
FLAG -256 48 R
IOPIN -256 48 In
FLAG -96 48 S
IOPIN -96 48 In
FLAG 320 64 Q
IOPIN 320 64 Out
FLAG 672 64 Qb
IOPIN 672 64 Out
FLAG 112 64 a
FLAG 464 64 b
FLAG -32 304 G
IOPIN -32 304 In
SYMBOL bv 112 112 R0
WINDOW 0 50 50 Left 2
WINDOW 3 -4 218 Left 2
SYMATTR InstName BQ
SYMATTR Value V=If((V(R,G)<2.5) & ((V(S,G)>2.5) | (V(Qb,G)<2.5)),5,100m)
SYMBOL res -208 96 R0
SYMATTR InstName R1
SYMATTR Value 1Meg
SYMBOL res -48 96 R0
SYMATTR InstName R2
SYMATTR Value 1Meg
SYMBOL res 256 48 R90
WINDOW 0 0 56 VBottom 2
WINDOW 3 32 56 VTop 2
SYMATTR InstName R3
SYMATTR Value 10
SYMBOL cap 272 128 R0
WINDOW 0 45 19 Left 2
WINDOW 3 48 46 Left 2
WINDOW 123 48 74 Left 2
SYMATTR InstName C1
SYMATTR Value 10p
SYMATTR Value2 IC=0
SYMBOL bv 464 112 R0
WINDOW 0 45 58 Left 2
WINDOW 3 -2 183 Left 2
SYMATTR InstName BQB
SYMATTR Value V=If((V(R,G)>2.5) | ((V(Q,G)<2.5) & (V(S,G)<2.5)),5,100m)
SYMBOL res 608 48 R90
WINDOW 0 0 56 VBottom 2
WINDOW 3 32 56 VTop 2
SYMATTR InstName R4
SYMATTR Value 10
SYMBOL cap 624 128 R0
WINDOW 0 45 19 Left 2
WINDOW 3 48 46 Left 2
WINDOW 123 48 74 Left 2
SYMATTR InstName C2
SYMATTR Value 10p
SYMATTR Value2 IC=5

xfmr_3w.asc, the sub-circuit schematic file:
Version 4.1
SHEET 1 880 680
WIRE 32 96 -48 96
WIRE 160 96 32 96
WIRE 368 96 304 96
WIRE 496 96 448 96
WIRE 624 96 576 96
WIRE 32 144 32 96
WIRE 160 144 160 96
WIRE 304 144 304 96
WIRE 32 288 32 224
WIRE 32 288 -48 288
WIRE 160 288 160 224
WIRE 160 288 32 288
WIRE 304 288 304 224
WIRE 624 288 304 288
WIRE 368 352 304 352
WIRE 496 352 448 352
WIRE 624 352 576 352
WIRE 304 400 304 352
WIRE 304 544 304 480
WIRE 624 544 304 544
FLAG 624 288 4
IOPIN 624 288 Out
FLAG 624 96 3
IOPIN 624 96 Out
FLAG -48 96 1
IOPIN -48 96 In
FLAG -48 288 2
IOPIN -48 288 In
FLAG 624 544 6
IOPIN 624 544 Out
FLAG 624 352 5
IOPIN 624 352 Out
SYMBOL bi 160 144 R0
WINDOW 0 45 39 Left 2
WINDOW 3 -320 182 Left 2
SYMATTR InstName B1
SYMATTR Value I=I(V1)*{ratio12}+I(V2)*{ratio13}
SYMBOL bv 304 128 R0
WINDOW 0 40 42 Left 2
WINDOW 3 40 70 Left 2
SYMATTR InstName B2
SYMATTR Value V=V(1,2)*{ratio12}
SYMBOL voltage 352 96 R270
WINDOW 0 32 56 VTop 2
WINDOW 3 -32 56 VBottom 2
WINDOW 123 0 0 Left 0
WINDOW 39 0 0 Left 0
SYMATTR InstName V1
SYMATTR Value 0
SYMBOL res 592 80 R90
WINDOW 0 0 56 VBottom 2
WINDOW 3 32 56 VTop 2
SYMATTR InstName R1
SYMATTR Value 1µ
SYMBOL res 16 128 R0
SYMATTR InstName R2
SYMATTR Value 1Meg
SYMBOL bv 304 384 R0
WINDOW 0 40 42 Left 2
WINDOW 3 40 70 Left 2
SYMATTR InstName B3
SYMATTR Value V=V(1,2)*{ratio13}
SYMBOL voltage 352 352 R270
WINDOW 0 32 56 VTop 2
WINDOW 3 -32 56 VBottom 2
WINDOW 123 0 0 Left 0
WINDOW 39 0 0 Left 0
SYMATTR InstName V2
SYMATTR Value 0
SYMBOL res 592 336 R90
WINDOW 0 0 56 VBottom 2
WINDOW 3 32 56 VTop 2
SYMATTR InstName R3
SYMATTR Value 1µ

xfmr.asc, the sub-circuit schematic file:
Version 4.1
SHEET 1 880 680
WIRE 32 96 -48 96
WIRE 160 96 32 96
WIRE 368 96 304 96
WIRE 496 96 448 96
WIRE 624 96 576 96
WIRE 32 144 32 96
WIRE 160 144 160 96
WIRE 304 144 304 96
WIRE 32 288 32 224
WIRE 32 288 -48 288
WIRE 160 288 160 224
WIRE 160 288 32 288
WIRE 304 288 304 224
WIRE 624 288 304 288
FLAG 624 288 4
IOPIN 624 288 Out
FLAG 624 96 3
IOPIN 624 96 Out
FLAG -48 96 1
IOPIN -48 96 In
FLAG -48 288 2
IOPIN -48 288 In
SYMBOL bi 160 144 R0
WINDOW 0 45 39 Left 2
WINDOW 3 -63 163 Left 2
SYMATTR InstName B1
SYMATTR Value I=I(V1)*{ratio}
SYMBOL bv 304 128 R0
WINDOW 0 40 42 Left 2
WINDOW 3 40 70 Left 2
SYMATTR InstName B2
SYMATTR Value V=V(1,2)*{ratio}
SYMBOL voltage 352 96 R270
WINDOW 0 32 56 VTop 2
WINDOW 3 -32 56 VBottom 2
WINDOW 123 0 0 Left 0
WINDOW 39 0 0 Left 0
SYMATTR InstName V1
SYMATTR Value 0
SYMBOL res 592 80 R90
WINDOW 0 0 56 VBottom 2
WINDOW 3 32 56 VTop 2
SYMATTR InstName R1
SYMATTR Value 1µ
SYMBOL res 16 128 R0
SYMATTR InstName R2
SYMATTR Value 1Meg

The netlist it stands for:
* Forward CM - 2SW - nonisolated - cbc.asc
R1 N010 0 {Ri}
R2 N010 CS {Rr}
D2 P001 N006 MBRS360
L1 N006 N007 25µ
rL N008 N007 1m
rC N008 N011 22m
C2 N011 0 1.2m
R3 Vout 0 {Rload}
Vin Vin 0 48
C1 CS 0 100p
Rlower N015 0 {Rlower}
Rupper Vout N015 {Rupper}
C3 N017 CMP {C1}
R4 N015 N017 {R2}
C4 N015 CMP {C2}
D4 0 N006 MBRS360
V6 N025 0 {Rlower}
V7 N024 0 {Rupper}
V8 N023 0 {R2}
V9 N022 0 {C2}
V10 N021 0 {C1}
V11 N020 0 {Rr}
V12 N019 0 {S1}
V13 N029 0 {fz}
V14 N028 0 {fp}
VIout N008 Vout 0
V2 N018 0 {Se}
V3 N027 0 {Sn}
V4 N026 0 {Smag}
Lmag s d 1m
D3 d Vin DBUCK
D5 0 s DBUCK
M1 d N014 N010 N010 IPD320N20N3
C6 N012 N005 0.22µ
R9 N002 N001 47
D6 N002 N003 1N4148
Q1 s N004 N003 0 2N2907
R10 N004 N001 1k
M2 Vin N003 s s IPD320N20N3
R11 N013 N009 47
D7 N013 N014 1N4148
Q2 N010 N016 N014 0 2N2907
R12 N016 N009 1k
D8 N005 N012 1N4148
X§X4 CS N015 0 CMP N012 NC_01 generic_cm_pwm params: gain={gain} pole={pole} Isink={Isink} Isource={Isource} Vlow={VOL} Vhigh={VOH}
X§X5 N005 0 N001 s N009 N010 xfmr_3w params: Ratio12=2 Ratio13=2
X§X2 s d P001 0 xfmr params: ratio=900m

* block symbol definitions
.subckt generic_cm_pwm CS FB GNDT CMP DRV DRVB
A7 GNDT N002 GNDT N006 GNDT GNDT QDT GNDT AND Vhigh=5 Vlow=0 Ref=2.5
A8 N004 GNDT GNDT GNDT GNDT N005 N002 GNDT BUF Vhigh=5 Vlow=0 Ref=1.0
A9 N002 GNDT GNDT GNDT GNDT GNDT N006 GNDT BUF Vhigh=5 Vlow=0 Ref=2.5 Td={DT}
A10 GNDT N005 GNDT N008 GNDT GNDT QbDT GNDT AND Vhigh=5 Vlow=0 Ref=2.5
A11 N005 GNDT GNDT GNDT GNDT GNDT N008 GNDT BUF Vhigh=5 Vlow=0 Ref=2.5 Td={DT}
B3 N001 GNDT V=IF(V(QDT,GNDT)>2.5,{VDRV},100m)
B4 N009 GNDT V=IF(V(QbDT,GNDT)>2.5,{VDRV},100m)
R3 DRVB N009 10
C3 DRVB GNDT 10p
R4 DRV N001 10
C4 DRV GNDT 10p
X§X5 N010 FB GNDT CMP op_amp_fan_out params: gain={gain} pole={pole} Isink={Isink} Isource={Isource} Vlow={VOL} Vhigh={VOH}
A12 GNDT N013 N015 N011 GNDT GNDT N007 GNDT OR Vhigh=5 Vlow=0 Ref=2.5
V5 N010 GNDT {Vref}
V8 N003 GNDT PULSE(0 5 0 1n 1n 150n {Tsw})
VmaxDC N015 GNDT PULSE(0 5 {Dutymax*Tsw} 1n 1n {0.01*Tsw} {Tsw})
B1 N012 GNDT V=IF(V(CMP,GNDT)/3>{VCS},{VCS},V(CMP,GNDT)/3)
V1 ramp GNDT PULSE(0 2.5 0 {Tsw-2n} 1n 1n {Tsw})
VSS N014 GNDT PWL(0 100m {TSS} 2.6)
R2 CS N016 19k
B2 N016 GNDT V=IF(V(QDT,GNDT)>2.5,V(ramp,GNDT),0)
X§X2 N012 CS N013 GNDT comptof_g params: VHIGH=5 VLOW=100m VHYS=10m
X§X3 N014 ramp N011 GNDT comptof_g params: VHIGH=5 VLOW=100m VHYS=10m
X§X1 N007 N003 N004 NC_01 GNDT sr_latch_g
.ends generic_cm_pwm

.subckt op_amp_fan_out + - Masse OUT
G1 Masse N004 + - 100µ
R1 N004 Masse {GAIN/100u}
C1 N004 Masse {1/(6.28*(GAIN/100u)*POLE)}
D1 Masse N004 dopamp
E1 N005 Masse N004 Masse 1
D3 N005 N006 dopamp
I1 N006 Masse {ISINK/185}
Q1 Masse N006 N003 0 2N3906
V1 OUT N003 {VLOW-700m}
I2 N002 OUT {Isource}
D4 OUT N002 dopamp
V3 N001 Masse {VHIGH}
D2 N004 N002 dopamp
R2 N002 N001 10
*
.model dopamp D RS=1m VFWD=1m TT=10n Cjo=10p
*
.ends op_amp_fan_out

.subckt comptof_g INV NINV OUT G
B1 HYS NINV V=IF(V(out) > ({VHIGH}+{VLOW})/2,{VHYS},0)
B2 N001 G V=IF(V(HYS,INV)>0,{VHIGH},{VLOW})
R1 N001 OUT 10
C1 OUT G 10p
R2 INV G 1Meg
.ends comptof_g

.subckt sr_latch_g R S Q Qb G
BQ a G V=If((V(R,G)<2.5) & ((V(S,G)>2.5) | (V(Qb,G)<2.5)),5,100m)
R1 R G 1Meg
R2 S G 1Meg
R3 Q a 10
C1 Q G 10p IC=0
BQB b G V=If((V(R,G)>2.5) | ((V(Q,G)<2.5) & (V(S,G)<2.5)),5,100m)
R4 Qb b 10
C2 Qb G 10p IC=5
.ends sr_latch_g

.subckt xfmr_3w 1 2 3 4 5 6
B1 1 2 I=I(V1)*{ratio12}+I(V2)*{ratio13}
B2 N001 4 V=V(1,2)*{ratio12}
V1 N001 N002 0
R1 3 N002 1µ
R2 1 2 1Meg
B3 N003 6 V=V(1,2)*{ratio13}
V2 N003 N004 0
R3 5 N004 1µ
.ends xfmr_3w

.subckt xfmr 1 2 3 4
B1 1 2 I=I(V1)*{ratio}
B2 N001 4 V=V(1,2)*{ratio}
V1 N001 N002 0
R1 3 N002 1µ
R2 1 2 1Meg
.ends xfmr

.model D D
.lib standard.dio
.model NPN NPN
.model PNP PNP
.lib standard.bjt
.model NMOS NMOS
.model PMOS PMOS
.lib standard.mos
*
.model DBUCK D TT=10n Rs=10m Cjo=120p N=0.6 BV=150
.model TOFSW SW (Ron=10m Roff=10Meg Vt=2 Vh=1)
.model DCLP D RS=10 VFWD=1m TT=10n
*
*
.param Vin=36
.param Vout=12
.param L=25u
.param Lmag=1m
.param Ri=40m
.param Ts=10u ; please update clock and ramp generators *
.param N=900m
*
.param Gfc=-8.9 ; magnitude at crossover
.param PS=-52 ; phase lag at crossover
*
* Enter Design Goals Information Here *
*
.param fc=5k ; targeted crossover
.param PM=60 ; choose phase margin at crossover
*
.param Sramp={2.5/Tsw} ; 2.5 V over Ts - check your IC specs
.param D={Vout/(N*Vin)} ; duty ratio calculation
.param Smag={Vin*Ri/Lmag} ; natural forward slope
.param Sn={(((N*Vin-Vout)/L)*N)*Ri} ; secondary slope at the primary
.param Se={Sn*(0.818/(1-D)-1)}
.param S1=If(Smag>Se,0,Se-Smag)
.param Rr={(S1/Sramp)*19k+100} ; Rr=100 ohms for 0 compensation
*
* Enter the Values for Vout and Bridge Bias Current *
*
.param Ibias=1m
.param Rlower={Vref/Ibias}
.param Rupper={(Vout-Vref)/Ibias}
*
* Do not edit the below lines *
*
.param boost={PM-PS-90}
.param G={10**(-Gfc/20)}
.param fp={(tan(boost*pi/180)+sqrt((tan(boost*pi/180))**2+1))*fc}
.param fz={fc**2/fp}
.param a={sqrt((fc**2/fp**2)+1)}
.param b={sqrt((fz**2/fc**2)+1)}
.param R2={((a/b)*G*Rupper*fp)/(fp-fz)}
.param C1={1/(2*pi*R2*fz)}
.param C2={C1/(C1*R2*2*pi*fp-1)}
*
.tran 0 4.9m 4.8m 100n uic
.options abstol=1u vntol=1m reltol=0.01 gmin=100p
+method=gear
* The dc labels are the values of the components:
* pV --> pF
* nV --> nF
* kV --> kOhms
* *
* Slopes are in V/s
* Se is determined for a Q of 1
* If Smag>Se, no need for slope comp
* If Smag<Se, add missing slope to match Se
*
.param Fsw=100k
.param Tsw={1/Fsw}
.param Dutymax=0.45 ; maximum duty ratio
.param DT=50n ; deadtime between outputs
.param VDRV=12 ; DRV output
.param VCS=0.6 ; max Vsense
*
*
.param P=150 ; output power
.param Rload={Vout**2/P} ; nominal 100% load
*
.param AOL=90
.param GAIN={10**(AOL/20)}
.param pole=30
.param Isink=20m
.param Isource=500u
.param VOL=100m
.param VOH=3
*
.param Vref=2.5
.param Tss=5m
*
.backanno
.end